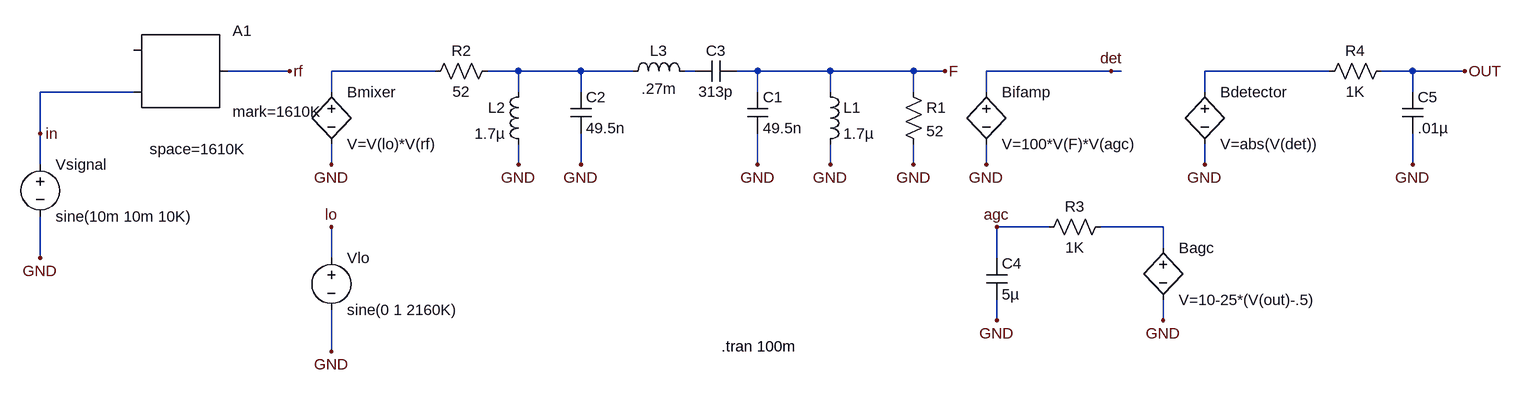
[diagram p0: schematic mixer.asc]
mixer.asc, the LTspice schematic file:
Version 4
SHEET 1 3788 1460
WIRE 2256 1152 2256 1120
WIRE 2256 1040 2256 1008
WIRE 2256 1008 2352 1008
WIRE 2512 1008 2528 1008
WIRE 2592 1008 2624 1008
WIRE 2736 1008 2736 1040
WIRE 2736 1120 2736 1152
WIRE 2352 1152 2352 1104
WIRE 2352 1040 2352 1008
WIRE 2352 1008 2432 1008
WIRE 2624 1008 2624 1040
WIRE 2624 1104 2624 1152
WIRE 2624 1008 2736 1008
WIRE 2736 1008 2864 1008
WIRE 2864 1008 2864 1040
WIRE 2864 1120 2864 1152
WIRE 2256 1008 2208 1008
WIRE 2128 1008 1968 1008
WIRE 2976 1152 2976 1120
WIRE 2976 1040 2976 1008
WIRE 2976 1008 3168 1008
WIRE 2864 1008 2912 1008
WIRE 3168 1008 3184 1008
WIRE 3312 1152 3312 1120
WIRE 3312 1040 3312 1008
WIRE 3312 1008 3504 1008
WIRE 3248 1392 3248 1360
WIRE 3248 1280 3248 1248
WIRE 2992 1392 2992 1360
WIRE 2992 1296 2992 1248
WIRE 2992 1248 3072 1248
WIRE 3152 1248 3248 1248
WIRE 1968 1248 1968 1296
WIRE 1968 1376 1968 1440
WIRE 3584 1008 3632 1008
WIRE 3632 1008 3632 1040
WIRE 3632 1104 3632 1152
WIRE 3632 1008 3712 1008
WIRE 1968 1152 1968 1120
WIRE 1968 1040 1968 1008
WIRE 1520 1232 1520 1296
WIRE 1808 1008 1904 1008
WIRE 1664 1040 1520 1040
WIRE 1520 1040 1520 1104
WIRE 1520 1104 1520 1152
FLAG 2736 1152 GND
FLAG 2624 1152 GND
FLAG 2352 1152 GND
FLAG 2256 1152 GND
FLAG 2864 1152 GND
FLAG 2976 1152 GND
FLAG 2912 1008 F
FLAG 3168 1008 det
FLAG 3312 1152 GND
FLAG 3712 1008 OUT
FLAG 3248 1392 GND
FLAG 2992 1392 GND
FLAG 2992 1248 agc
FLAG 1968 1440 GND
FLAG 3632 1152 GND
FLAG 1968 1152 GND
FLAG 1968 1248 lo
FLAG 1520 1296 GND
FLAG 1520 1104 in
FLAG 1904 1008 rf
SYMBOL ind 2720 1024 R0
SYMATTR InstName L1
SYMATTR Value 1.7µ
SYMBOL cap 2608 1040 R0
SYMATTR InstName C1
SYMATTR Value 49.5n
SYMBOL cap 2336 1040 R0
SYMATTR InstName C2
SYMATTR Value 49.5n
SYMBOL ind 2272 1024 M0
SYMATTR InstName L2
SYMATTR Value 1.7µ
SYMBOL ind 2416 1024 R270
WINDOW 0 32 56 VTop 0
WINDOW 3 5 56 VBottom 0
SYMATTR InstName L3
SYMATTR Value .27m
SYMBOL cap 2592 992 R90
WINDOW 0 0 32 VBottom 0
WINDOW 3 32 32 VTop 0
SYMATTR InstName C3
SYMATTR Value 313p
SYMBOL res 2848 1024 R0
SYMATTR InstName R1
SYMATTR Value 52
SYMBOL res 2224 992 R90
WINDOW 0 0 56 VBottom 0
WINDOW 3 32 56 VTop 0
SYMATTR InstName R2
SYMATTR Value 52
SYMBOL bv 2976 1024 R0
SYMATTR InstName Bifamp
SYMATTR Value V=100*V(F)*V(agc)
SYMBOL bv 3312 1024 R0
SYMATTR InstName Bdetector
SYMATTR Value V=abs(V(det))
SYMBOL bv 3248 1264 R0
SYMATTR InstName Bagc
SYMATTR Value V=10-25*(V(out)-.5)
SYMBOL res 3168 1232 R90
WINDOW 0 0 56 VBottom 0
WINDOW 3 32 56 VTop 0
SYMATTR InstName R3
SYMATTR Value 1K
SYMBOL cap 2976 1296 R0
SYMATTR InstName C4
SYMATTR Value 5µ
SYMBOL voltage 1968 1280 R0
SYMATTR InstName Vlo
SYMATTR Value sine(0 1 2160K)
SYMBOL res 3600 992 R90
WINDOW 0 0 56 VBottom 0
WINDOW 3 32 56 VTop 0
SYMATTR InstName R4
SYMATTR Value 1K
SYMBOL cap 3616 1040 R0
SYMATTR InstName C5
SYMATTR Value .01µ
SYMBOL bv 1968 1024 R0
SYMATTR InstName Bmixer
SYMATTR Value V=V(lo)*V(rf)
SYMBOL voltage 1520 1136 R0
SYMATTR InstName Vsignal
SYMATTR Value sine(10m 10m 10K)
SYMBOL SpecialFunctions\modulate 1664 976 R0
WINDOW 123 24 152 Left 0
SYMATTR InstName A1
SYMATTR Value mark=1610K
SYMATTR Value2 space=1610K
text 2568 1432 Left 0 !.tran 100m

The netlist it stands for:
* mixer.asc
L1 F GND 1.7µ
C1 F GND 49.5n
C2 N001 GND 49.5n
L2 N001 GND 1.7µ
L3 N001 N002 .27m
C3 F N002 313p
R1 F GND 52
R2 N001 N003 52
Bifamp det GND V=100*V(F)*V(agc)
Bdetector N004 GND V=abs(V(det))
Bagc N005 GND V=10-25*(V(out)-.5)
R3 N005 agc 1K
C4 agc GND 5µ
Vlo lo GND sine(0 1 2160K)
R4 OUT N004 1K
C5 OUT GND .01µ
Bmixer N003 GND V=V(lo)*V(rf)
Vsignal in GND sine(10m 10m 10K)
A1 0 in 0 0 0 0 rf 0 MODULATOR mark=1610K space=1610K
.tran 100m
.backanno
.end